# Altium schematic sheet ws_pcb.SchDoc
size A4
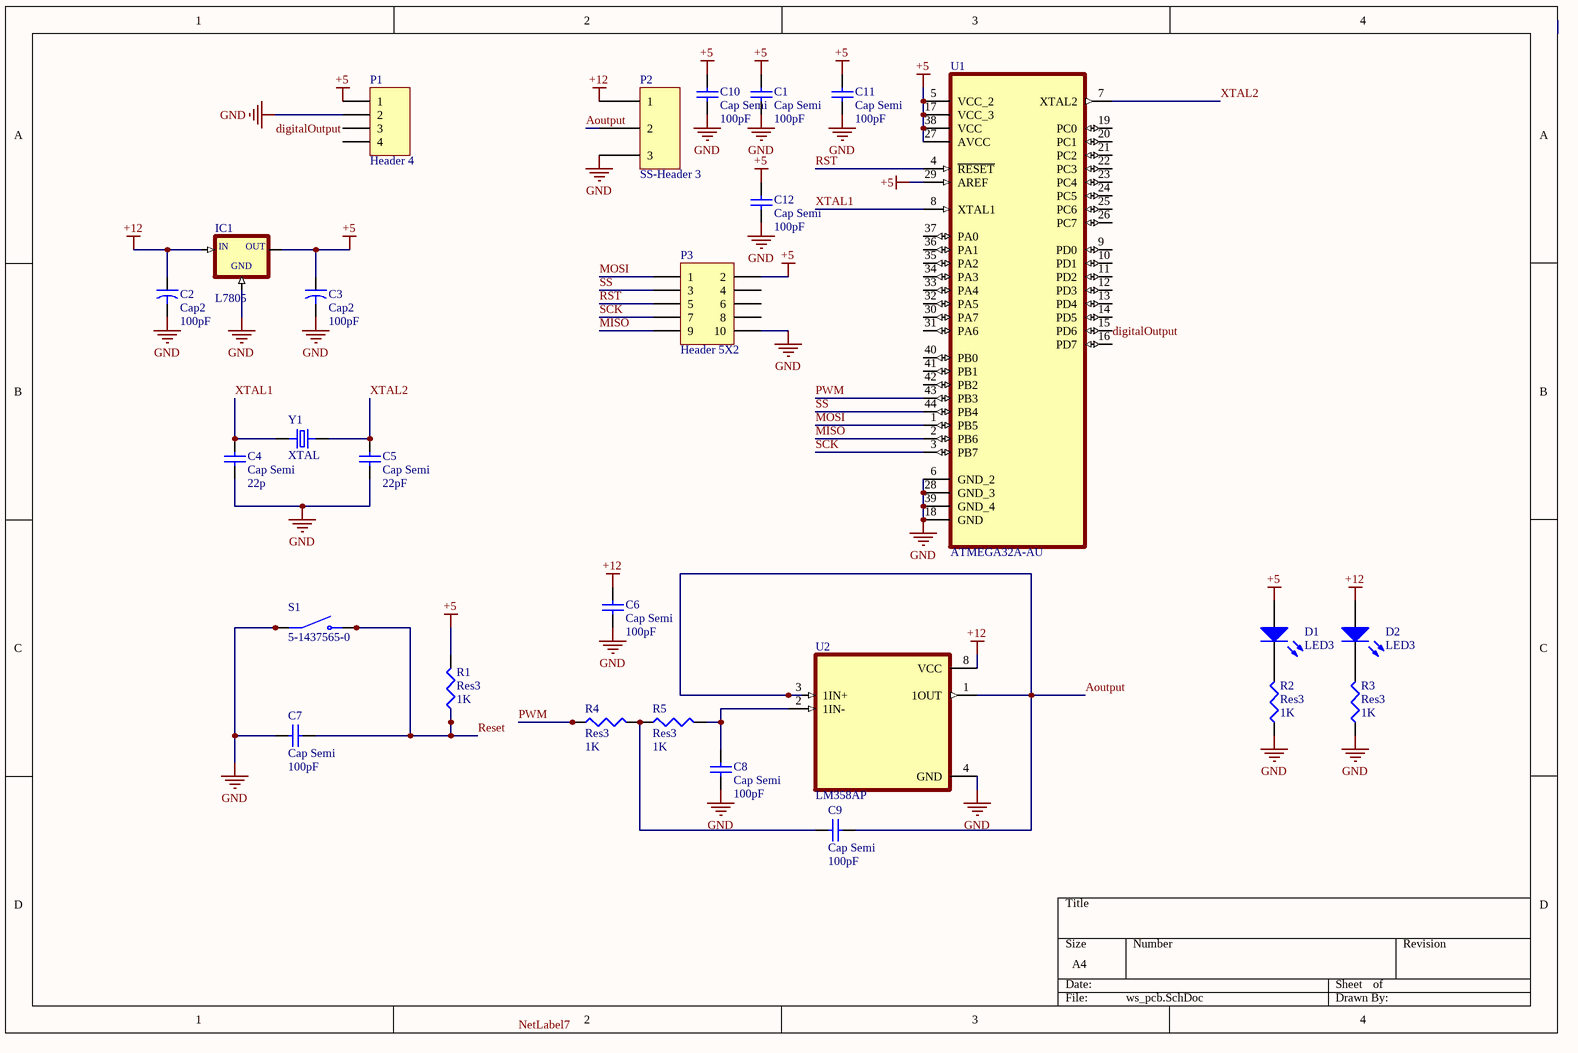
[diagram p0: ws_pcb.SchDoc]

## Parts
C1  Cap Semi  value 100pF  [C1210]
C2  Cap2  value 100pF  [CAPR5-4X5]
C3  Cap2  value 100pF  [CAPR5-4X5]
C4  Cap Semi  value 22p  [C1210]
C5  Cap Semi  value 22pF  [C1210]
C6  Cap Semi  value 100pF  [C1210]
C7  Cap Semi  value 100pF  [C1210]
C8  Cap Semi  value 100pF  [C1210]
C9  Cap Semi  value 100pF  [C1210]
C10  Cap Semi  value 100pF  [C1210]
C11  Cap Semi  value 100pF  [C1210]
C12  Cap Semi  value 100pF  [C1210]
D1  LED3  [3.5X2.8X1.9]
D2  LED3  [3.5X2.8X1.9]
IC1  L7805  [78XXS]
P1  Header 4  [HDR1X4]
P2  SS-Header 3  [PCBComponent_1]
P3  Header 5X2  [HDR2X5]
R1  Res3  value 1K  [14-1210]
R2  Res3  value 1K  [14-1210]
R3  Res3  value 1K  [14-1210]
R4  Res3  value 1K  [14-1210]
R5  Res3  value 1K  [14-1210]
S1  5-1437565-0  [SW_5-1437565-0]
U1  ATMEGA32A-AU  [QFP80P1200X1200X120-44N]
U2  LM358AP  [DIP794W45P254L959H508Q8]
Y1  XTAL  [XTAL_ECS-200-20-1X]

## Nets
+5: C1.2 C3.1 C10.2 C11.2 C12.2 D1.1(A) IC1.OUT P1.1 P3.2 R1.2 U1.5(VCC_2) U1.17(VCC_3) U1.27(AVCC) U1.29(AREF) U1.38(VCC)
+12: C2.1 C6.2 D2.1(A) IC1.IN P2.1 U2.8(VCC)
GND: C1.1 C2.2 C3.2 C4.1 C5.1 C6.1 C7.2 C8.1 C10.1 C11.1 C12.1 IC1.GND P1.2 P2.3 P3.10 R2.1 R3.1 S1.1(COM) S1.2(COM) U1.6(GND_2) U1.18(GND) U1.28(GND_3) U1.39(GND_4) U2.4(GND)
Aoutput: C9.2 P2.2 U2.1(1OUT) U2.3(1IN+)
digitalOutput: P1.3 U1.15(PD6)
MISO: P3.9 U1.2(PB6)
MOSI: P3.1 U1.1(PB5)
PWM: R4.1 U1.43(PB3)
Reset: C7.1 R1.1 S1.3(NO) S1.4(NO)
RST: P3.5 U1.4(~{RESET})
SCK: P3.7 U1.3(PB7)
SS: P3.3 U1.44(PB4)
XTAL1: C4.2 U1.8(XTAL1) Y1.1
XTAL2: C5.2 U1.7(XTAL2) Y1.2
NetC8_2: C8.2 R5.2 U2.2(1IN-)
NetC9_1: C9.1 R4.2 R5.1
NetD1_2: D1.2(K) R2.2
NetD2_2: D2.2(K) R3.2

Not connected (* = marked no-connect by the designer): P1 4; P3 4 6 8; U1 9(PD0) 10(PD1) 11(PD2) 12(PD3) 13(PD4) 14(PD5) 16(PD7) 19(PC0) 20(PC1) 21(PC2) 22(PC3) 23(PC4) 24(PC5) 25(PC6) 26(PC7) 30(PA7) 31(PA6) 32(PA5) 33(PA4) 34(PA3) 35(PA2) 36(PA1) 37(PA0) 40(PB0) 41(PB1) 42(PB2); U2 5(2IN+) 6(2IN-) 7(2OUT)

## Notes on the sheet
- Labels drawn without touching a wire or pin: NetLabel7

## Library data of the parts
C1 C4-C12 = Cap Semi: Capacitor (Semiconductor SIM Model); Published: 8-Jun-2000; LatestRevisionDate: 29-May-2009; LatestRevisionNote: IPC-7351 Footprint Added.; PackageReference: C1206; Publisher: Altium Limited; PackageDescription: Chip Capacitor
C2 C3 = Cap2: Capacitor; Published: 23-Sep-2002; PackageReference: CAPR5-4X5; Publisher: Altium Limited; PackageDescription: Capacitor; 2 Leads
D1 D2 = LED3: Typical BLUE SiC LED; Published: 8-Jun-2000; LatestRevisionDate: 17-Dec-2003; LatestRevisionNote: PCB Footprint replaced.; DatasheetVersion: 16-Apr-2002; PackageVersion: 16-Apr-2002; PackageReference: 3.5X2.8X1.9; Publisher: Altium Limited; PackageDescription: SM LED; 2 C-Bend Leads; Body 3.5 x 2.8 x 1.9 mm, inc leads (LxWxH typ)
IC1 = L7805: Linear Voltage Regulator IC 1 Output 1.5A D2PAK; MF: STMicroelectronics; Package: TO-263-3 Inchange Semiconductor; Availability: Unavailable; MP: L7805; Value: *; SnapEDA_Link: https://www.snapeda.com/parts/L7805/STMicroelectronics/view-part/563125/?ref=snap; Price: None
P1 = Header 4: Header, 4-Pin; LatestRevisionDate: 17-Jul-2002; LatestRevisionNote: Re-released for DXP Platform.; Publisher: Altium Limited
P2 = Component_1: Slimseal 3-Pin Connector
P3 = Header 5X2: Header, 5-Pin, Dual row; LatestRevisionDate: 17-Jul-2002; LatestRevisionNote: Re-released for DXP Platform.; Publisher: Altium Limited
R1-R5 = Res3: Resistor; Published: 8-Jun-2000; LatestRevisionDate: 29-May-2009; LatestRevisionNote: IPC-7351 Footprint Added.; PackageReference: J1-0603; Publisher: Altium Limited; PackageDescription: Chip Resistor
S1 = 5-1437565-0: Tactile Switch SPST-NO Top Actuated Surface Mount; MF: TE Connectivity; Price: None; TE_purchase_URL: https://www.te.com/usa-en/product-5-1437565-0.html?te_bu=Cor&te_type=disp&te_campaign=seda_glo_cor-seda-global-disp-prtnr-fy19-seda-model-bom-cta_sma-317_1&elqCampaignId=32493; Value: *; Package: None; EU_RoHS_Compliance: Compliant; Availability: Unavailable; MP: 5-1437565-0; SnapEDA_Link: https://www.snapeda.com/parts/5-1437565-0/TE%20Connectivity%20ALCOSWITCH%20Switches/view-part/227152/?ref=snap
U1 = ATMEGA32A-AU: AVR AVRÂ® ATmega Microcontroller IC 8-Bit 16MHz 32KB _16K x 16_ FLASH 44-TQFP _10x10_; MF: Microchip; Value: *; Price: None; Package: TQFP-44 Microchip; SnapEDA_Link: https://www.snapeda.com/parts/ATMEGA32A-AU/Microchip/view-part/666512/?ref=snap; Availability: Unavailable; MP: ATMEGA32A-AU
U2 = LM358AP: Dual improved offset, standard operational amplifier<br /> &nbsp; 8-PDIP 0 to 70; MF: Texas Instruments; Price: None; Value: *; Availability: Unavailable; SnapEDA_Link: https://www.snapeda.com/parts/LM358AP/Texas%20Instruments/view-part/214423/?ref=snap; MP: LM358AP; Texas_Instruments-Purchase-URL: https://snapeda.com/shop?store=Texas+Instruments&id=214423; Package: PDIP-8 Texas Instruments; BuyPart: https://www.snapeda.com/parts/LM358AP/Texas%20Instruments/view-part/214423/?ref=eda
Y1 = ECS-240.0001-18-1X: Crystals / Oscillators / Resonators 24.00014MHz 18pF; MF: ECS International; Package: HC49/U ECS International; Availability: Unavailable; Value: *; MP: ECS-240.0001-18-1X; Price: None; SnapEDA_Link: https://www.snapeda.com/parts/ECS-240.0001-18-1X/ECS%20International/view-part/259232/?ref=snap